# EAGLE design copycat_atten (EAGLE 9.6.2)
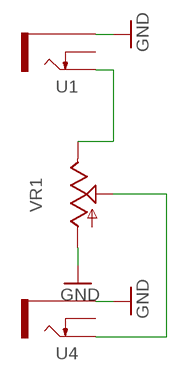
[diagram p0: schematic, sheet 1]

## Parts
U1  THONKICONNNEW  [WQP-PJ301M-12_JACK]
U4  THONKICONNNEW  [WQP-PJ301M-12_JACK]
VR1  9MM_SNAP-IN_POT_  [9MM_SNAP-IN_POT]

## Nets
GND: U1.P$3_SLEEVE(SLEEVE) U4.P$3_SLEEVE(SLEEVE) VR1.1(A)
N$1: U4.P$1_TIP(TIP) VR1.2(S)
N$2: U1.P$1_TIP(TIP) VR1.3(E)
Unconnected: U1.P$2_SWITCH(SWITCH) U4.P$2_SWITCH(SWITCH)

## Library data of the parts
U1 U4 = MusicThingModular:THONKICONN: 3.5mm socket for Eurorack modular synths
VR1 = MusicThingModular:9MM_SNAP-IN_POT: 9mm vertical snap-in pot, Alpha / Panasonic style

## Board
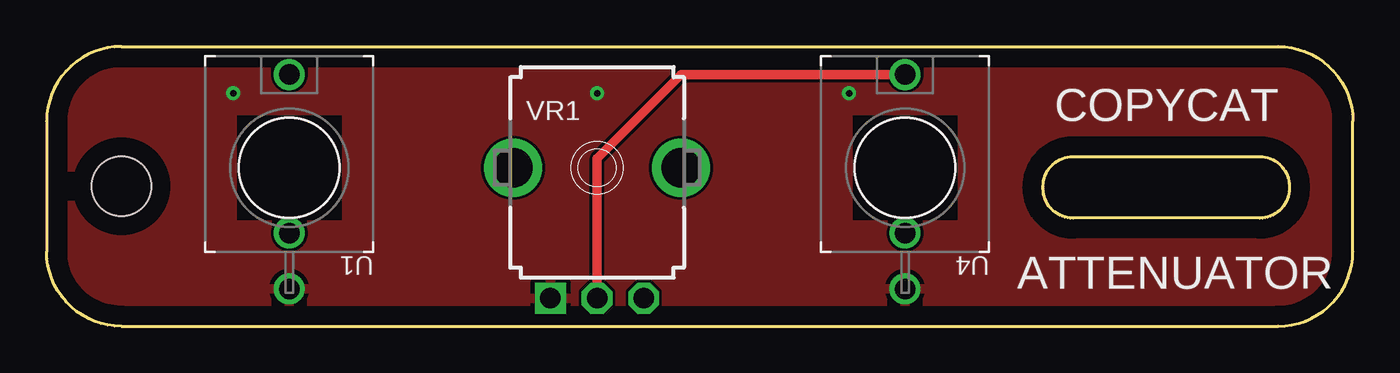
[diagram p1: board, top side]
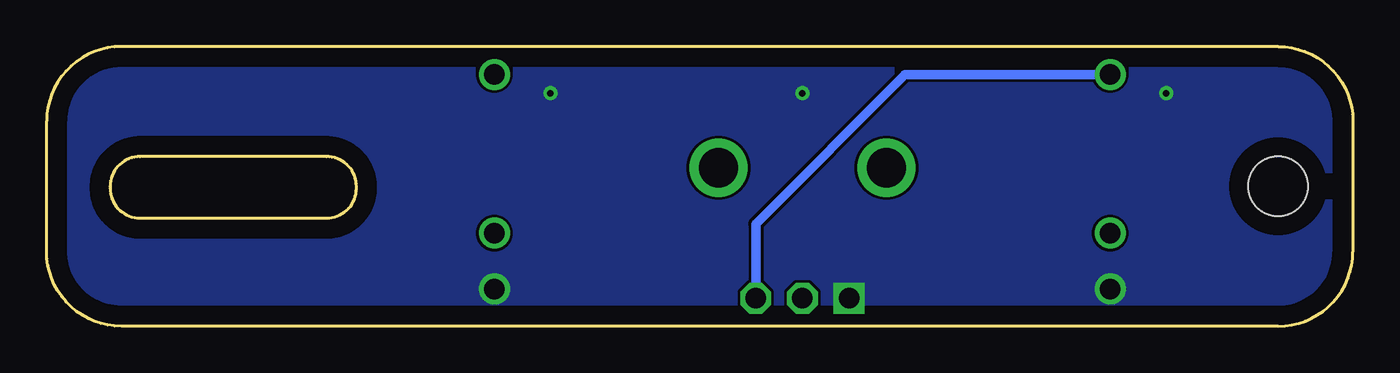
[diagram p2: board, bottom side, seen from below]

Size 70 x 15 mm. Coordinates in mm from the lower left corner, seen from the top.
Outline: 4,15 66,15 arc-90 70,11 70,4 arc-90 66,0 4,0 arc-90 0,4 0,11 arc-90 4,15
Outline: 55,5.8 arc-90 53.4,7.4 53.4,7.5 arc-90 55,9.1 65,9.1 arc-90 66.6,7.5 66.6,7.4 arc-90 65,5.8 55,5.8
Copper layers (1*16): Top 0.035mm / dielectric 1.5mm / Bottom 0.035mm
Design rules "default": minimum track width 6mil, minimum drill 0.35mm, track to track 6mil, track to pad 6mil, pad to pad 6mil, via to via 6mil, smd to smd 6mil, copper to edge 40mil, drill to drill 6mil, minimum pad ring 10mil, minimum via ring 8mil, stop-mask expansion 4mil, vias tented up to drill 0mil, thermal gap 10mil
Holes 3.2 mm at 4,7.5

### Footprints (pad centres in the part's own frame; a part is rotated, then mirrored left to right if it is on the bottom)
WQP-PJ301M-12_JACK = drill 1.1: P$1_TIP 0,5; P$2_SWITCH 0,-3.5; P$3_SLEEVE 0,-6.5
9MM_SNAP-IN_POT = drill 1.1 square: 1 -2.5,-7 | drill 1.1 octagon: 2 0,-7; 3 2.5,-7 | drill 2.1 pad 2.794: CHASSIS1 -4.5,0; CHASSIS2 4.5,0

### Placement (x,y rotation side)
U1  13,8.5 0 top
U4  46,8.5 0 top
VR1  29.5,8.5 0 top

### Tracks (layer width: path | path; a pad name or v marks a point on that pad's centre or on a via)
GND  (via drill 0.35)
  other vias: 10,12.5 29.5,12.5 43,12.5
  pour Top: 0,15.5 0,-0.5 70,-0.5 70,15.5
  pour Bottom (no thermals): 0,15.5 0,-0.5 70,-0.5 70,15.5
N$1
  Top 0.508: VR1.2 29.5,9 34,13.5 U4.P$1_TIP
N$2
  Bottom 0.508: U1.P$1_TIP 24,13.5 32,5.5 VR1.3

### Text on the board
tPlace: COPYCAT | ATTENUATOR